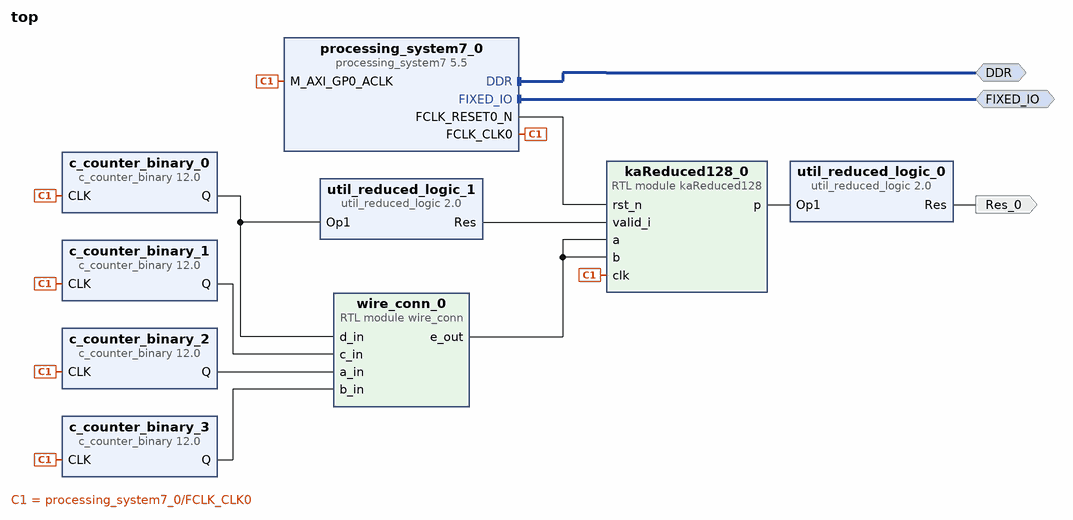
[diagram p0: block diagram of the top level]
# Vivado block design top, xc7z020clg484-1, Vivado 2022.2
create_bd_design top

create_bd_intf_port -mode Master -vlnv xilinx.com:interface:ddrx_rtl:1.0 DDR
create_bd_intf_port -mode Master -vlnv xilinx.com:display_processing_system7:fixedio_rtl:1.0 FIXED_IO
create_bd_port -dir O Res_0

create_bd_cell -type ip -vlnv xilinx.com:ip:processing_system7:5.5 processing_system7_0
set_property -dict {CONFIG.PCW_FPGA0_PERIPHERAL_FREQMHZ 100} [get_bd_cells processing_system7_0]
# 30 more settings of processing_system7_0 are not shown: defaults, MIO pin electricals, DDR timing, and values the tool derives
create_bd_cell -type ip -vlnv xilinx.com:ip:util_reduced_logic:2.0 util_reduced_logic_0
set_property -dict {CONFIG.C_OPERATION xor CONFIG.C_SIZE 2048} [get_bd_cells util_reduced_logic_0]
create_bd_cell -type ip -vlnv xilinx.com:ip:c_counter_binary:12.0 c_counter_binary_0
set_property -dict {CONFIG.Output_Width 256} [get_bd_cells c_counter_binary_0]
create_bd_cell -type ip -vlnv xilinx.com:ip:util_reduced_logic:2.0 util_reduced_logic_1
set_property -dict {CONFIG.C_SIZE 256} [get_bd_cells util_reduced_logic_1]
create_bd_cell -type ip -vlnv xilinx.com:ip:c_counter_binary:12.0 c_counter_binary_1
set_property -dict {CONFIG.Count_Mode DOWN CONFIG.Output_Width 256} [get_bd_cells c_counter_binary_1]
create_bd_cell -type ip -vlnv xilinx.com:ip:c_counter_binary:12.0 c_counter_binary_2
set_property -dict {CONFIG.Output_Width 256} [get_bd_cells c_counter_binary_2]
create_bd_cell -type ip -vlnv xilinx.com:ip:c_counter_binary:12.0 c_counter_binary_3
set_property -dict {CONFIG.Output_Width 256} [get_bd_cells c_counter_binary_3]
create_bd_cell -type module -reference kaReduced128 kaReduced128_0
create_bd_cell -type module -reference wire_conn wire_conn_0

# ---- connections ----

connect_bd_intf_net [get_bd_intf_ports DDR] [get_bd_intf_pins processing_system7_0/DDR]
connect_bd_intf_net [get_bd_intf_ports FIXED_IO] [get_bd_intf_pins processing_system7_0/FIXED_IO]
connect_bd_net [get_bd_pins c_counter_binary_0/Q] [get_bd_pins util_reduced_logic_1/Op1] [get_bd_pins wire_conn_0/d_in]
connect_bd_net [get_bd_pins c_counter_binary_1/Q] [get_bd_pins wire_conn_0/c_in]
connect_bd_net [get_bd_pins c_counter_binary_2/Q] [get_bd_pins wire_conn_0/a_in]
connect_bd_net [get_bd_pins c_counter_binary_3/Q] [get_bd_pins wire_conn_0/b_in]
connect_bd_net [get_bd_pins kaReduced128_0/p] [get_bd_pins util_reduced_logic_0/Op1]
connect_bd_net [get_bd_pins processing_system7_0/FCLK_CLK0] \
  [get_bd_pins processing_system7_0/M_AXI_GP0_ACLK] [get_bd_pins c_counter_binary_0/CLK] [get_bd_pins c_counter_binary_1/CLK] \
  [get_bd_pins c_counter_binary_2/CLK] [get_bd_pins c_counter_binary_3/CLK] [get_bd_pins kaReduced128_0/clk]
connect_bd_net [get_bd_pins processing_system7_0/FCLK_RESET0_N] [get_bd_pins kaReduced128_0/rst_n]
connect_bd_net [get_bd_pins util_reduced_logic_0/Res] [get_bd_ports Res_0]
connect_bd_net [get_bd_pins util_reduced_logic_1/Res] [get_bd_pins kaReduced128_0/valid_i]
connect_bd_net [get_bd_pins wire_conn_0/e_out] [get_bd_pins kaReduced128_0/a] [get_bd_pins kaReduced128_0/b]

validate_bd_design
save_bd_design
